# Altium schematic sheet Regulador.SchDoc: GRUPO ALTECH
size A3; DocumentNumber: GA0070; SheetNumber: 1; SheetTotal: 4
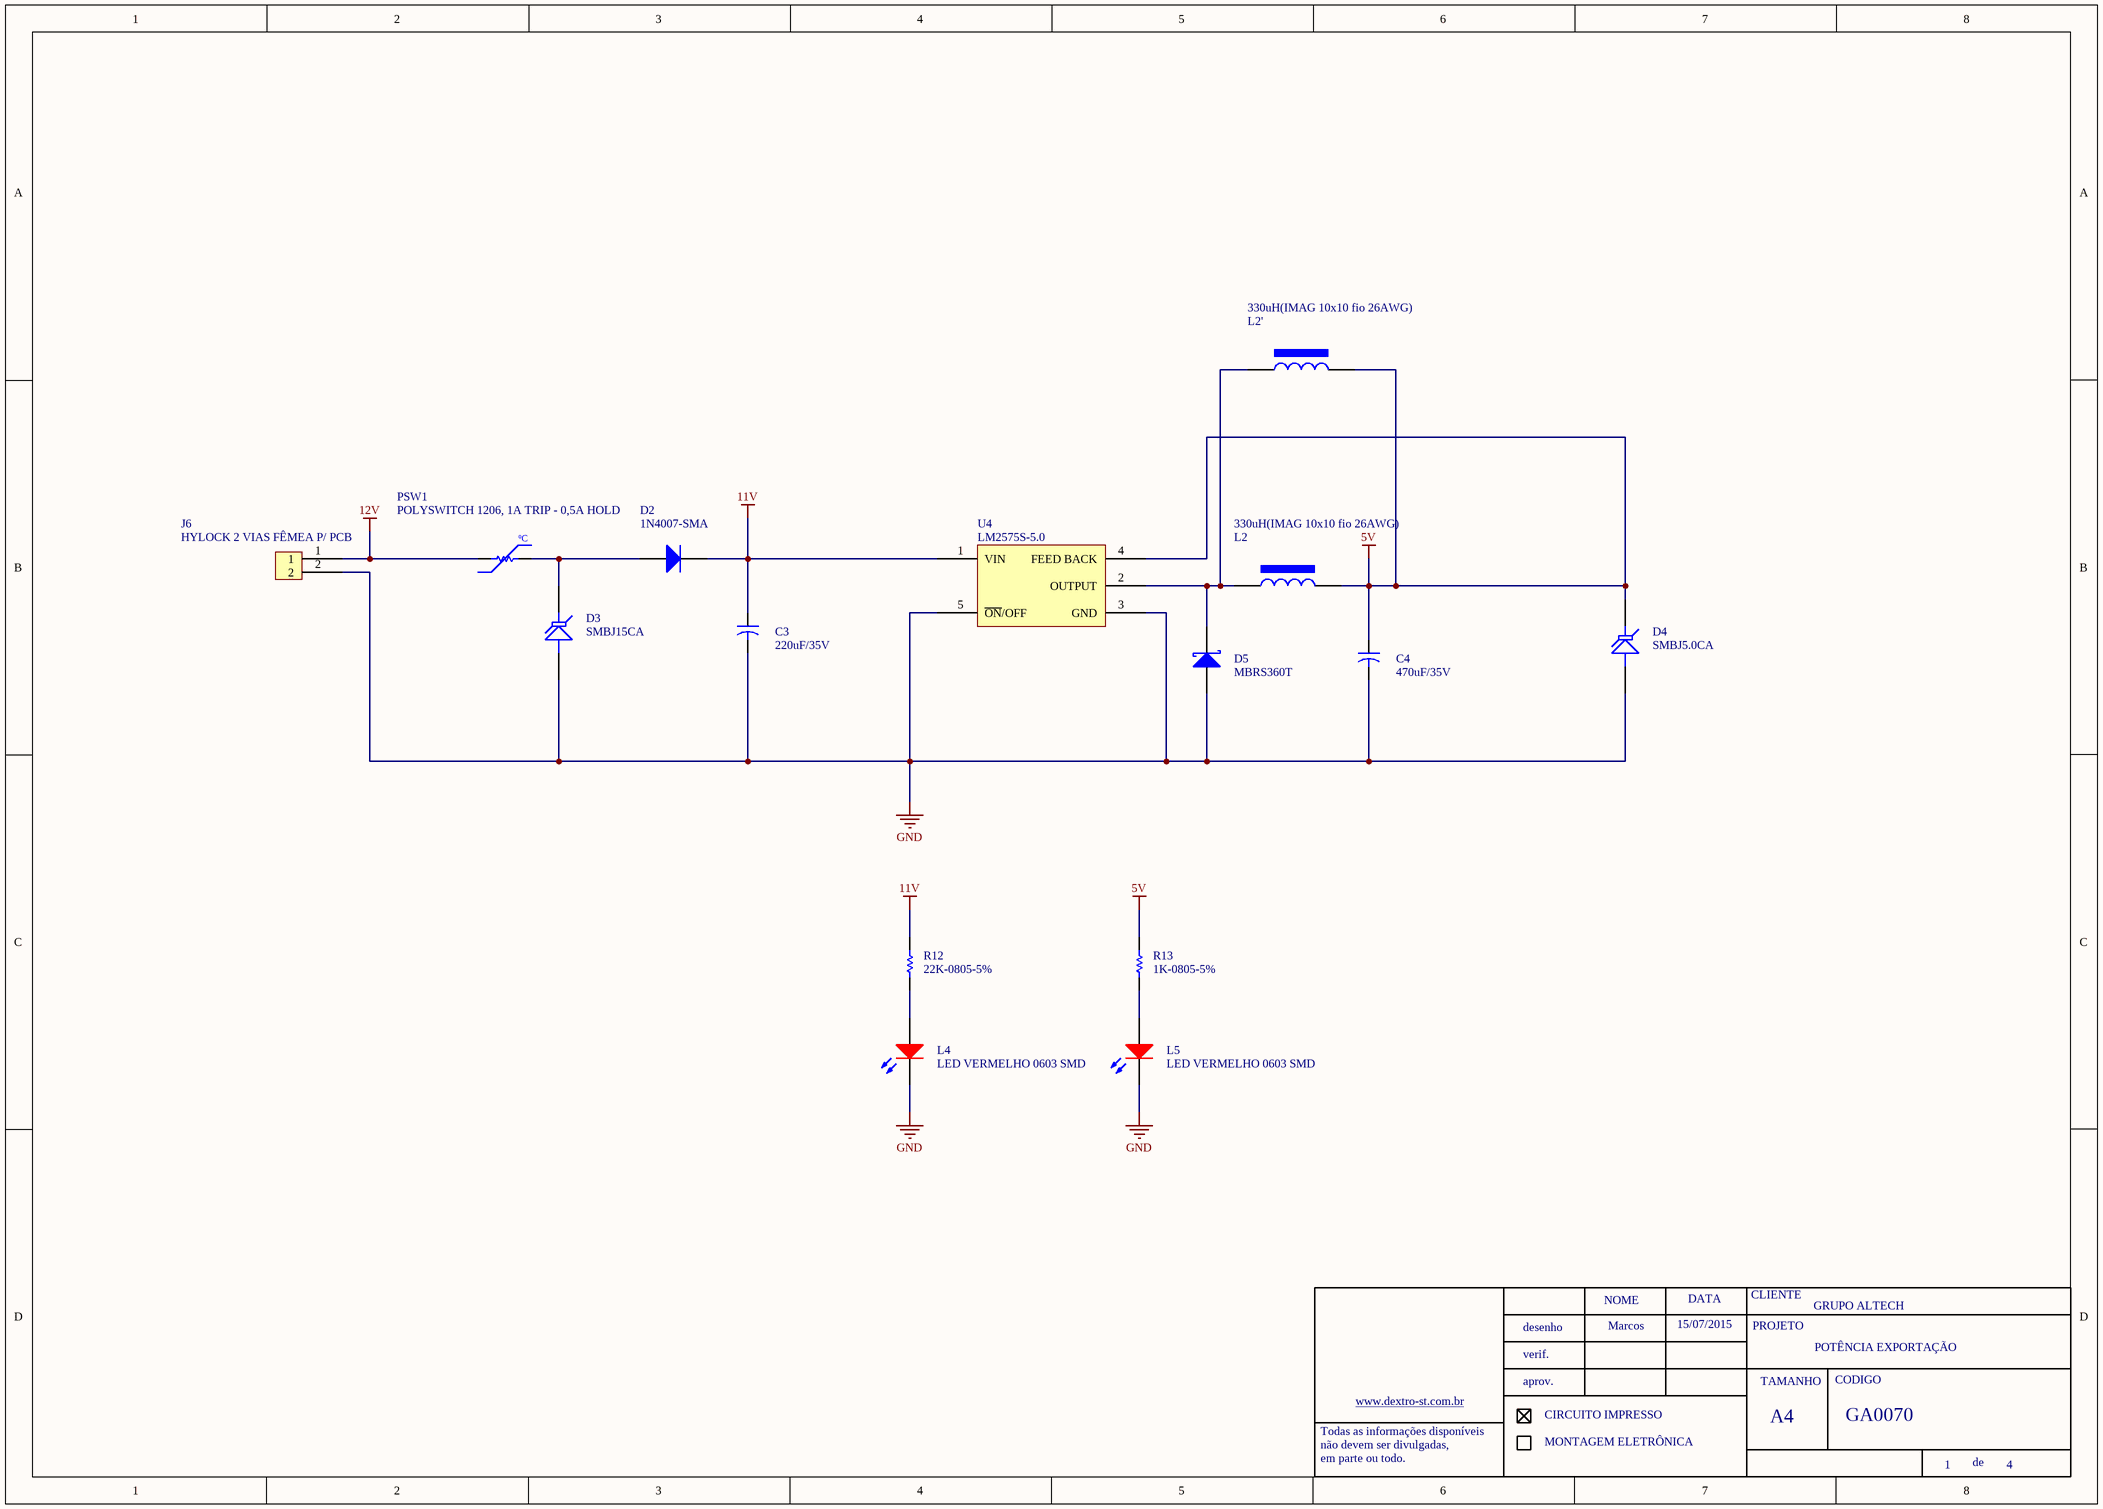
[diagram p0: Regulador.SchDoc]

## Parts
C3  220uF/35V  [CAP POL 8x12mm]
C4  470uF/35V  [CAP POL 8x12mm]
D2  1N4007-SMA  [DO-214AA]
D3  SMBJ15CA  [DO-214AA]
D4  SMBJ5.0CA  [DO-214AA]
D5  MBRS360T  [DO-214AA]
J6  HYLOCK 2 VIAS FÊMEA P/ PCB  [CONECTOR HYLOCK 2 VIAS]
L2  330uH(IMAG 10x10 fio 26AWG)  [INDUTOR 47mH]
L2'  330uH(IMAG 10x10 fio 26AWG)  [INDUTOR LOCO]
L4  LED VERMELHO 0603 SMD  [LED 1206]
L5  LED VERMELHO 0603 SMD  [LED 1206]
PSW1  POLYSWITCH 1206, 1A TRIP - 0,5A HOLD  [1206-REVISADO ONDA]
R12  22K-0805-5%  [0805-REVISADO ONDA]
R13  1K-0805-5%  [0805-REVISADO ONDA]
U4  LM2575S-5.0  [TO-263-5]

## Nets
5V: C4.1 D4.2(K) L2.1 L2'.1 R13.2 U4.4(FEED_BACK)
11V: C3.1 D2.2(K) R12.2 U4.1(VIN)
12V: J6.1 PSW1.1
GND: C3.2 C4.2 D3.1(A) D4.1(A) D5.1(A) J6.2 L4.2(K) L5.2(K) U4.3(GND) U4.5(~{ON}/OFF)
NetD2_1: D2.1(A) D3.2(K) PSW1.2
NetD5_2: D5.2(K) L2.2 L2'.2 U4.2(OUTPUT)
NetL4_1: L4.1(A) R12.1
NetL5_1: L5.1(A) R13.1

## Notes on the sheet
- Marcos
- 15/07/2015
- POTÊNCIA EXPORTAÇÃO
- NOME
- DATA
- CLIENTE
- PROJETO
- desenho
- verif.
- aprov.
- TAMANHO
- CODIGO
- Todas as informações disponíveis
- não devem ser divulgadas,
- em parte ou todo.
- www.dextro-st.com.br
- CIRCUITO IMPRESSO
- MONTAGEM ELETRÔNICA
- A4
- de
- (in symbol POLYSWITCH 200mA) ºC

## Library data of the parts
C3 = 2200uF/50V: ERP: 105.01.008
C4 = 470uF/50V: ERP: 105.01.005
D2 = 1N4007: ERP: 120.18.001
D3 = SMBJ30.0A: ERP: 128.02.003
D4 = SMBJ5.0A: ERP: 128.02.002
D5 = 1N5819-SOD80: ERP: 121.18.003
J6 = PCMC2-2
L2 L2' = indutor 1mH CNF15: 1mH-CNF15-26 AWG; ERP: 211.00.012
PSW1 = POLYSWITCH 200mA: NANOSMDC020F-2; ERP: 128.12.002
R13 = 22K-0805-5%: ERP: 102.11.058
U4 = LM2596S-ADJ
L4 L5 = LED VERMELHO 0603 SMD: ERP: 124.02.010
R12 = 22K-0805-5%: ERP: 102.11.058